# EAGLE design 4_Button_Array_LED_V2 (EAGLE 9.5.2)
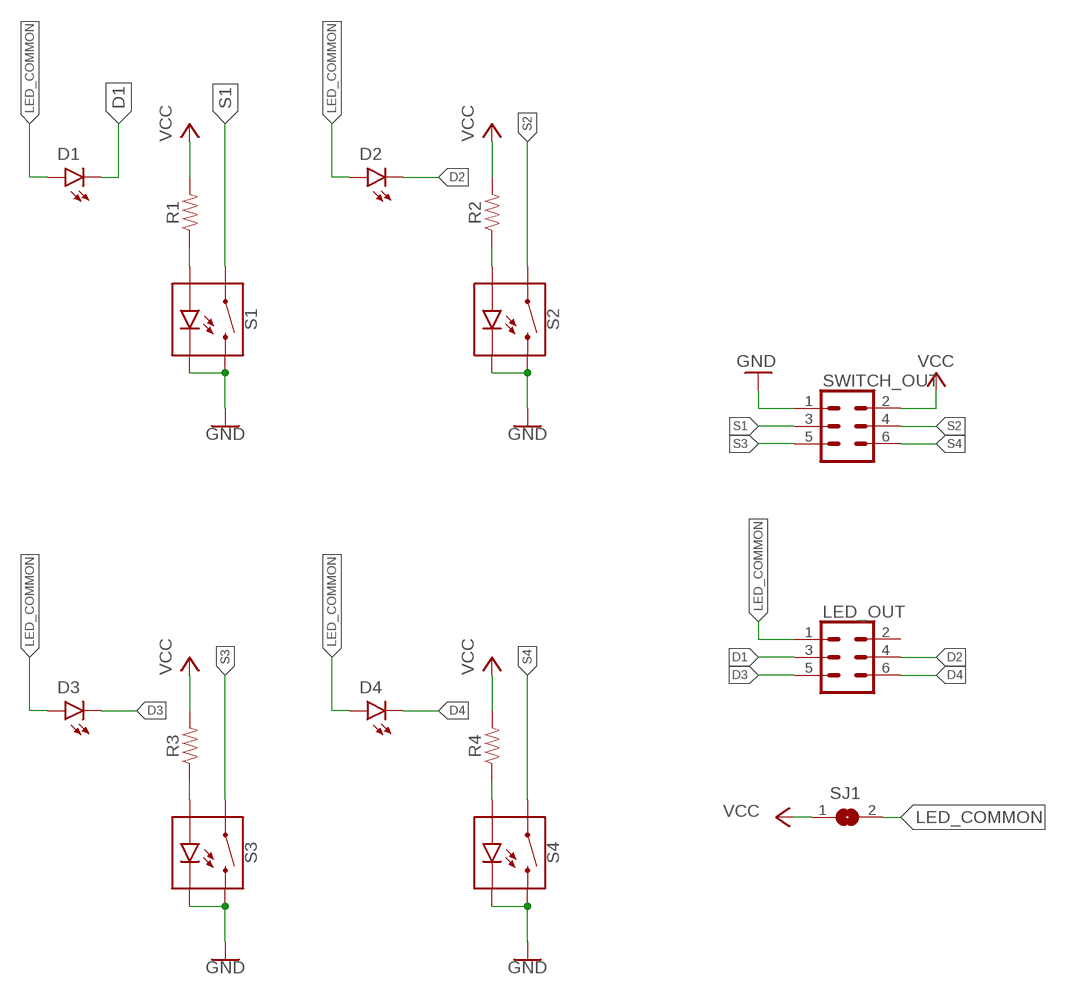
[diagram p0: schematic, sheet 1]

## Parts
D1  LED3MM  [LED_3MM]
D2  LED3MM  [LED_3MM]
D3  LED3MM  [LED_3MM]
D4  LED3MM  [LED_3MM]
LED_OUT  CONN_03X2SHROUD  [2X3-SHROUDED]
R1  RESISTOR1206  [1206]
R2  RESISTOR1206  [1206]
R3  RESISTOR1206  [1206]
R4  RESISTOR1206  [1206]
S1  MOMENTARY-SWITCH-SPST-LED-PTH-12MM  [TACTILE_SWITCH_LED_PTH_12MM]
S2  MOMENTARY-SWITCH-SPST-LED-PTH-12MM  [TACTILE_SWITCH_LED_PTH_12MM]
S3  MOMENTARY-SWITCH-SPST-LED-PTH-12MM  [TACTILE_SWITCH_LED_PTH_12MM]
S4  MOMENTARY-SWITCH-SPST-LED-PTH-12MM  [TACTILE_SWITCH_LED_PTH_12MM]
SJ1  SJ  [SJ]
SWITCH_OUT  CONN_03X2SHROUD  [2X3-SHROUDED]

## Nets
D1: D1.K(C) LED_OUT.3
D2: D2.K(C) LED_OUT.4
D3: D3.K(C) LED_OUT.5
D4: D4.K(C) LED_OUT.6
GND: S1.2 S1.C S2.2 S2.C S3.2 S3.C S4.2 S4.C SWITCH_OUT.1
LED_COMMON: D1.A D2.A D3.A D4.A LED_OUT.1 SJ1.2
N$1: R2.1 S2.A
N$2: R1.1 S1.A
N$3: R3.1 S3.A
N$4: R4.1 S4.A
S1: S1.4 SWITCH_OUT.3
S2: S2.4 SWITCH_OUT.4
S3: S3.4 SWITCH_OUT.5
S4: S4.4 SWITCH_OUT.6
VCC: R1.2 R2.2 R3.2 R4.2 SJ1.1 SWITCH_OUT.2
Unconnected: LED_OUT.2

## Library data of the parts
D1-D4 = SparkFun-LED:LED: LED (Generic) Standard schematic elements and footprints for 5mm, 3mm, 1206, and 0603 sized LEDs. Generic LEDs with no color specified.; PROD_ID: DIO-08794
LED_OUT SWITCH_OUT = SparkFun-Connectors:CONN_03X2: Multi connection point. Often used as Generic Header-pin footprint for 0.1 inch spaced/style header connections You can populate with any combo of single row headers, but if you'd like an exact match, check these: Header - 2x3 (Male, 0.1") <https://www.sparkfun.com/products/12807> (PRT-12807) Header - 2x3 (Female, 0.1") <https://www.sparkfun.com/products/13010> (PRT-13010) 2x3 Pin Shrouded Header <https://www.sparkfun.com/products/10877> (PRT-10877) On any of the 0.1 inch spaced packages, you can populate with these: Break Away Headers - Straight <https://www.sparkfun.com/products/116> (PRT-00116) Break Away Male Headers - Right Angle <https://www.sparkfun.com/products/553> (PRT-00553) Female Headers <https://www.sparkfun.com/products/115> (PRT-00115) Break Away Headers - Machine Pin <https://www.sparkfun.com/products/117> (PRT-00117) Break Away Female Headers - Swiss Machine Pin <https://www.sparkfun.com/products/743> (PRT-00743) Special note: the shrouded connector mates well with our 3x2 ribbon cables: Ribbon Crimp Connector - 6-pin (2x3, Female) <https://www.sparkfun.com/products/10651> (PRT-10651) Ribbon Cable - 6 wire (15ft) <https://www.sparkfun.com/products/10646> (PRT-10646); PROD_ID: CONN-10681; SF_ID: PRT_10877
R1-R4 = SparkFun-Resistors:RESISTOR: Generic Resistor Package
S1-S4 = SparkFun-Switches:MOMENTARY-SWITCH-SPST-LED: Momentary Switch (Pushbutton) - SPST - w/ LED Normally-open (NO) SPST momentary switches (buttons, pushbuttons), with a built-in LED. Variants PTH-CHERRY - Cherry MX Switch Cherry MX Keyswitches are top-of-the-line mechanical keyboard switches. They’re satisfyingly “clicky”, reliable up to tens-of-millions of key presses, and a standard in gaming and programming keyboards across the globe. This ‘blue’ version Cherry MX Switch is favored by most due to its secondary internal actuator making it less likely to “double-tap.” If you are looking for a noticeably audible and high-quality key switch, this is the perfect option for you! Cherry MX Switch <https://www.sparkfun.com/products/13834> (COM-13834) Cherry MX Switch Breakout <https://www.sparkfun.com/products/13773> (BOB-13773) PTH-12MM and PTH-12MM-KIT - 12mm Illuminated LED KIT variant is for soldering kits. There is no tStop (covering up the top side of the pads with mask). This helps the beginner see which side they should be soldering too. LED Tactile Button Breakout <https://www.sparkfun.com/products/10467> (BOB-10467) LED Tactile Button - Red <https://www.sparkfun.com/products/10442> (COM-10442) LED Tactile Button - Blue <https://www.sparkfun.com/products/10443> (COM-10443) LED Tactile Button - Green <https://www.sparkfun.com/products/10440> (COM-10440) LED Tactile Button - Orange <https://www.sparkfun.com/products/10441> (COM-10441) LED Tactile Button - White <https://www.sparkfun.com/products/10439> (COM-10439); PROD_ID: SWCH-11758; SF_SKU: COM-10442
SJ1 = jumper:SJ: SMD solder JUMPER

## Board
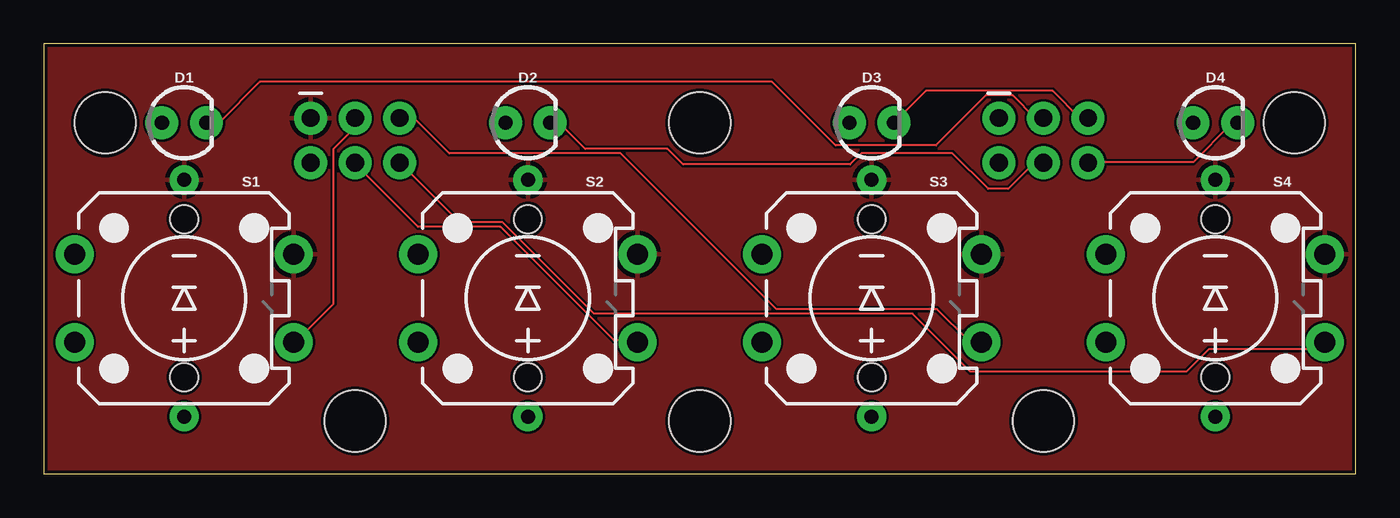
[diagram p1: board, top side]
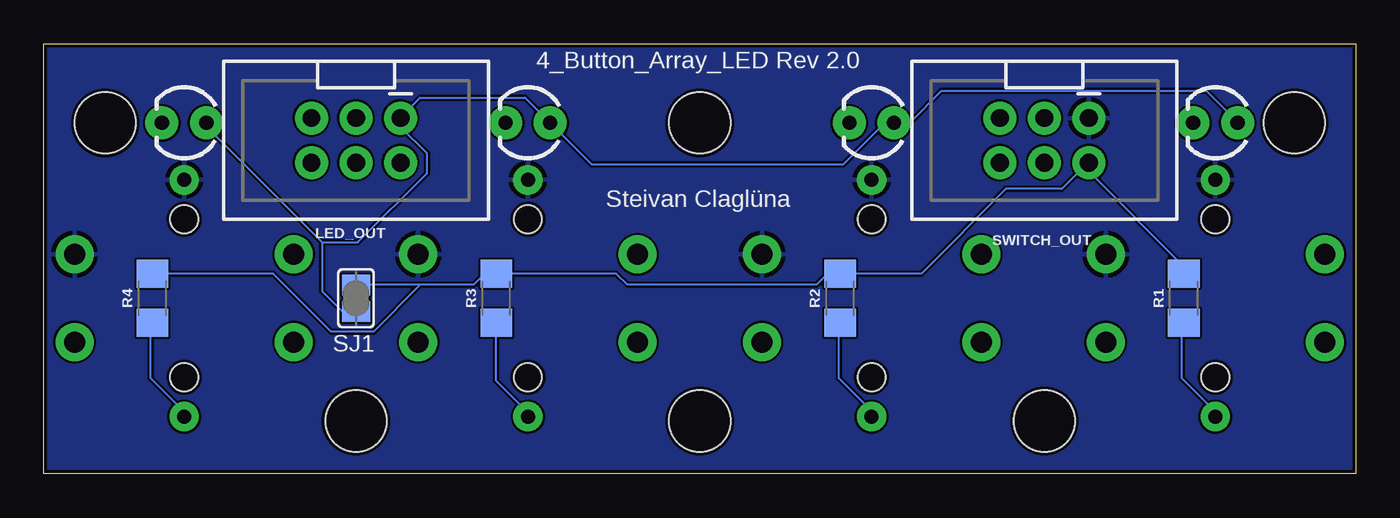
[diagram p2: board, bottom side, seen from below]

Size 74.8 x 24.5 mm. Coordinates in mm from the lower left corner, seen from the top.
Outline: 0,0 74.8,0 74.8,24.5 0,24.5 0,0
Copper layers (1*16): Top 0.035mm / dielectric 1.6mm / Bottom 0.035mm
Design rules "jlcpcb-2layers": minimum track width 5mil, minimum drill 0.3mm, track to track 5mil, track to pad 5mil, pad to pad 5mil, via to via 5mil, smd to smd 5mil, copper to edge 0.2mm, drill to drill 6mil, minimum pad ring 10mil, minimum via ring 3mil, stop-mask expansion 4mil, vias tented up to drill 0mil, thermal gap 10mil
Holes 3.5 mm at 3.5,20 71.3,20 37.4,20 17.75,3 37.4,3 57,3

### Footprints (pad centres in the part's own frame; a part is rotated, then mirrored left to right if it is on the bottom)
LED_3MM = drill 0.813 pad 1.88: A -1.27,0; K 1.27,0
2X3-SHROUDED = drill 1.016 pad 1.88: 1 -1.27,2.54; 2 1.27,2.54; 3 -1.27,0; 4 1.27,0; 5 -1.27,-2.54; 6 1.27,-2.54
1206 = smd 1.6 x 1.8: 1 -1.4,0; 2 1.4,0
TACTILE_SWITCH_LED_PTH_12MM = drill 1.2 pad 2.159: 1 -6.25,2.5; 2 6.25,2.5; 3 -6.25,-2.5; 4 6.25,-2.5 | drill 0.8 pad 1.676: A 0,-6.75; C 0,6.75 | hole 1.6: 0,4.5; 0,-4.5
SJ = smd 1.168 x 1.6: 1 -0.762,0; 2 0.762,0

### Placement (x,y rotation side)
D1  8,20 0 top
D2  27.6,20 0 top
D3  47.2,20 0 top
D4  66.8,20 0 top
LED_OUT  57,19 270 bottom
R1  9.8,10 90 bottom
R2  29.4,10 90 bottom
R3  49,10 90 bottom
R4  68.6,10 90 bottom
S1  8,10 0 top
S2  27.6,10 0 top
S3  47.2,10 0 top
S4  66.8,10 0 top
SJ1  57,10 270 bottom
SWITCH_OUT  17.75,19 270 bottom

### Tracks (layer width: path | path; a pad name or v marks a point on that pad's centre or on a via)
D1
  Top 0.127: D1.K 9.27,20.04 10.03,20.04 12.32,22.33 41.53,22.33 45.14,18.72 50.87,18.72 53.72,21.57 55.24,21.57 56.52,20.3 56.9,20.3 LED_OUT.3
D2
  Top 0.127: D2.K 28.96,19.91 29.46,19.91 30.86,18.52 35.56,18.52 36.45,17.63 45.97,17.63 46.61,18.26 51.82,18.26 53.85,16.23 54.99,16.23 56.39,17.63 56.9,17.63 LED_OUT.4
D3
  Top 0.127: D3.K 48.51,20.04 50.29,21.82 57.53,21.82 59.05,20.3 59.44,20.3 LED_OUT.5
D4
  Top 0.127: LED_OUT.6 59.56,17.76 65.53,17.76 67.69,19.91 67.94,19.91 D4.K
GND
  pour Top: 0.1,-0.1 74.9,-0.1 74.9,24.5 0.1,24.5
  pour Bottom: 0.1,-0.2 74.9,-0.2 74.9,24.5 0.1,24.5
LED_COMMON
  Bottom 0.127: D1.A 6.73,20.04 8.51,21.82 23.62,21.82 25.4,20.04 26.29,20.04 D2.A 26.42,19.91 26.92,19.91 29.21,17.63 43.56,17.63 D3.A 45.97,20.04 47.37,21.44 53.35,21.44 54.46,20.33 LED_OUT.1 54.46,19.76 52.96,18.26 52.96,17.12 56.9,13.18 58.93,13.18 | 58.93,13.18 58.93,10.39 57.78,9.25 57.02,9.25 SJ1.2 | 58.93,13.18 65.41,19.66 65.41,19.91 D4.A
N$1
  Bottom 0.127: R2.1 29.46,8.48 29.46,5.44 27.69,3.66 27.69,3.28 S2.A
N$2
  Bottom 0.127: R1.1 9.91,8.48 9.91,5.44 8,3.53 8,3.28 S1.A
N$3
  Bottom 0.127: R3.1 49.02,8.48 49.02,5.31 47.24,3.53 47.24,3.28 S3.A
N$4
  Bottom 0.127: R4.1 68.71,8.48 68.71,5.44 66.8,3.53 66.8,3.28 S4.A
S1
  Top 0.127: S1.4 14.32,7.5 16.51,9.69 16.51,18.52 17.65,19.66 17.65,20.17 SWITCH_OUT.3
S2
  Top 0.127: SWITCH_OUT.4 17.78,17.63 21.34,14.07 26.04,14.07 32.51,7.6 33.78,7.6 S2.4
S3
  Top 0.127: SWITCH_OUT.5 20.32,20.17 21.21,20.17 23.11,18.26 32.89,18.26 41.78,9.37 50.93,9.37 52.7,7.6 53.34,7.6 S3.4
S4
  Top 0.127: SWITCH_OUT.6 20.32,17.63 20.41,17.63 23.71,14.33 26.16,14.33 31.37,9.12 49.53,9.12 52.83,5.82 65.15,5.82 66.42,7.09 72.64,7.09 73.03,7.47 S4.4
VCC
  Bottom 0.127: 53.43,10.77 50.29,10.77 49.78,11.28 49.02,11.28 R3.2 48.9,11.41 42.16,11.41 41.53,10.77 30.73,10.77 30.23,11.28 29.46,11.28 R2.2 29.34,11.41 24.77,11.41 19.94,16.23 16.76,16.23 15.88,17.12 15.11,17.12 | 53.43,10.77 56.9,10.77 SJ1.1 | 53.43,10.77 53.43,10.69 56.01,8.1 58.42,8.1 61.72,11.41 68.58,11.41 R4.2 | 15.11,17.12 9.91,11.91 9.91,11.41 R1.2 | 15.11,17.12 15.11,17.63 SWITCH_OUT.2 15.11,17.12

### Text on the board
bNames: 4_Button_Array_LED Rev 2.0 | Steivan Claglüna